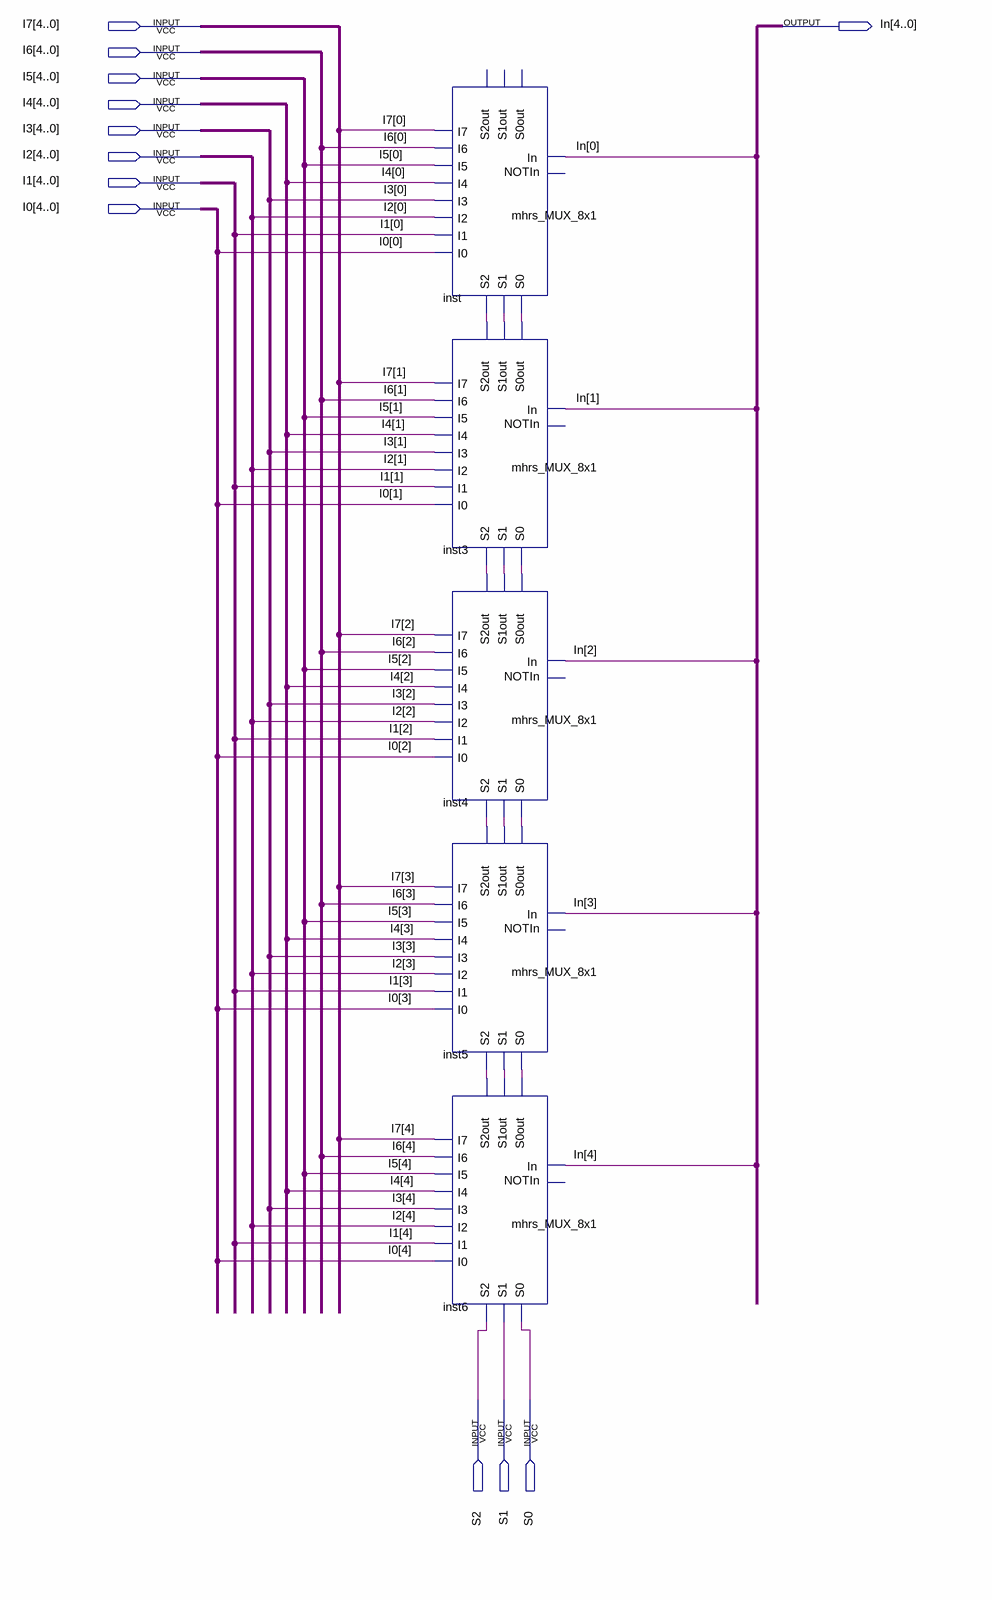
[diagram p0: schematic sheet]
// Quartus schematic mhrs_Mux_total_8x1.bdf as structural Verilog: 5 symbols, 12 pins
module mhrs_Mux_total_8x1 (
  input  [4:0] I7,
  input  [4:0] I6,
  input  [4:0] I5,
  input  [4:0] I4,
  input  [4:0] I3,
  input  [4:0] I2,
  input  [4:0] I1,
  input  [4:0] I0,
  input  S2,
  input  S1,
  input  S0,
  output [4:0] In
);

  wire inst3_s0out, inst3_s1out, inst3_s2out, inst4_s0out, inst4_s1out, inst4_s2out, inst5_s0out,
       inst5_s1out, inst5_s2out, inst6_s0out, inst6_s1out, inst6_s2out;

  mhrs_MUX_8x1 inst (
    .S2(inst3_s2out), .S1(inst3_s1out), .S0(inst3_s0out), .I7(I7[0]), .I6(I6[0]), .I5(I5[0]), .I4(I4[0]),
    .I3(I3[0]), .I2(I2[0]), .I1(I1[0]), .I0(I0[0]), .In(In[0]));  // open: S2out, S1out, S0out, NOTIn
  mhrs_MUX_8x1 inst3 (
    .S2(inst4_s2out), .S1(inst4_s1out), .S0(inst4_s0out), .I7(I7[1]), .I6(I6[1]), .I5(I5[1]), .I4(I4[1]),
    .I3(I3[1]), .I2(I2[1]), .I1(I1[1]), .I0(I0[1]), .S2out(inst3_s2out), .S1out(inst3_s1out),
    .S0out(inst3_s0out), .In(In[1]));  // open: NOTIn
  mhrs_MUX_8x1 inst4 (
    .S2(inst5_s2out), .S1(inst5_s1out), .S0(inst5_s0out), .I7(I7[2]), .I6(I6[2]), .I5(I5[2]), .I4(I4[2]),
    .I3(I3[2]), .I2(I2[2]), .I1(I1[2]), .I0(I0[2]), .S2out(inst4_s2out), .S1out(inst4_s1out),
    .S0out(inst4_s0out), .In(In[2]));  // open: NOTIn
  mhrs_MUX_8x1 inst5 (
    .S2(inst6_s2out), .S1(inst6_s1out), .S0(inst6_s0out), .I7(I7[3]), .I6(I6[3]), .I5(I5[3]), .I4(I4[3]),
    .I3(I3[3]), .I2(I2[3]), .I1(I1[3]), .I0(I0[3]), .S2out(inst5_s2out), .S1out(inst5_s1out),
    .S0out(inst5_s0out), .In(In[3]));  // open: NOTIn
  mhrs_MUX_8x1 inst6 (
    .S2(S2), .S1(S1), .S0(S0), .I7(I7[4]), .I6(I6[4]), .I5(I5[4]), .I4(I4[4]), .I3(I3[4]), .I2(I2[4]),
    .I1(I1[4]), .I0(I0[4]), .S2out(inst6_s2out), .S1out(inst6_s1out), .S0out(inst6_s0out), .In(In[4]));  // open: NOTIn
endmodule
